# EAGLE design 001 Display (EAGLE 5.00)
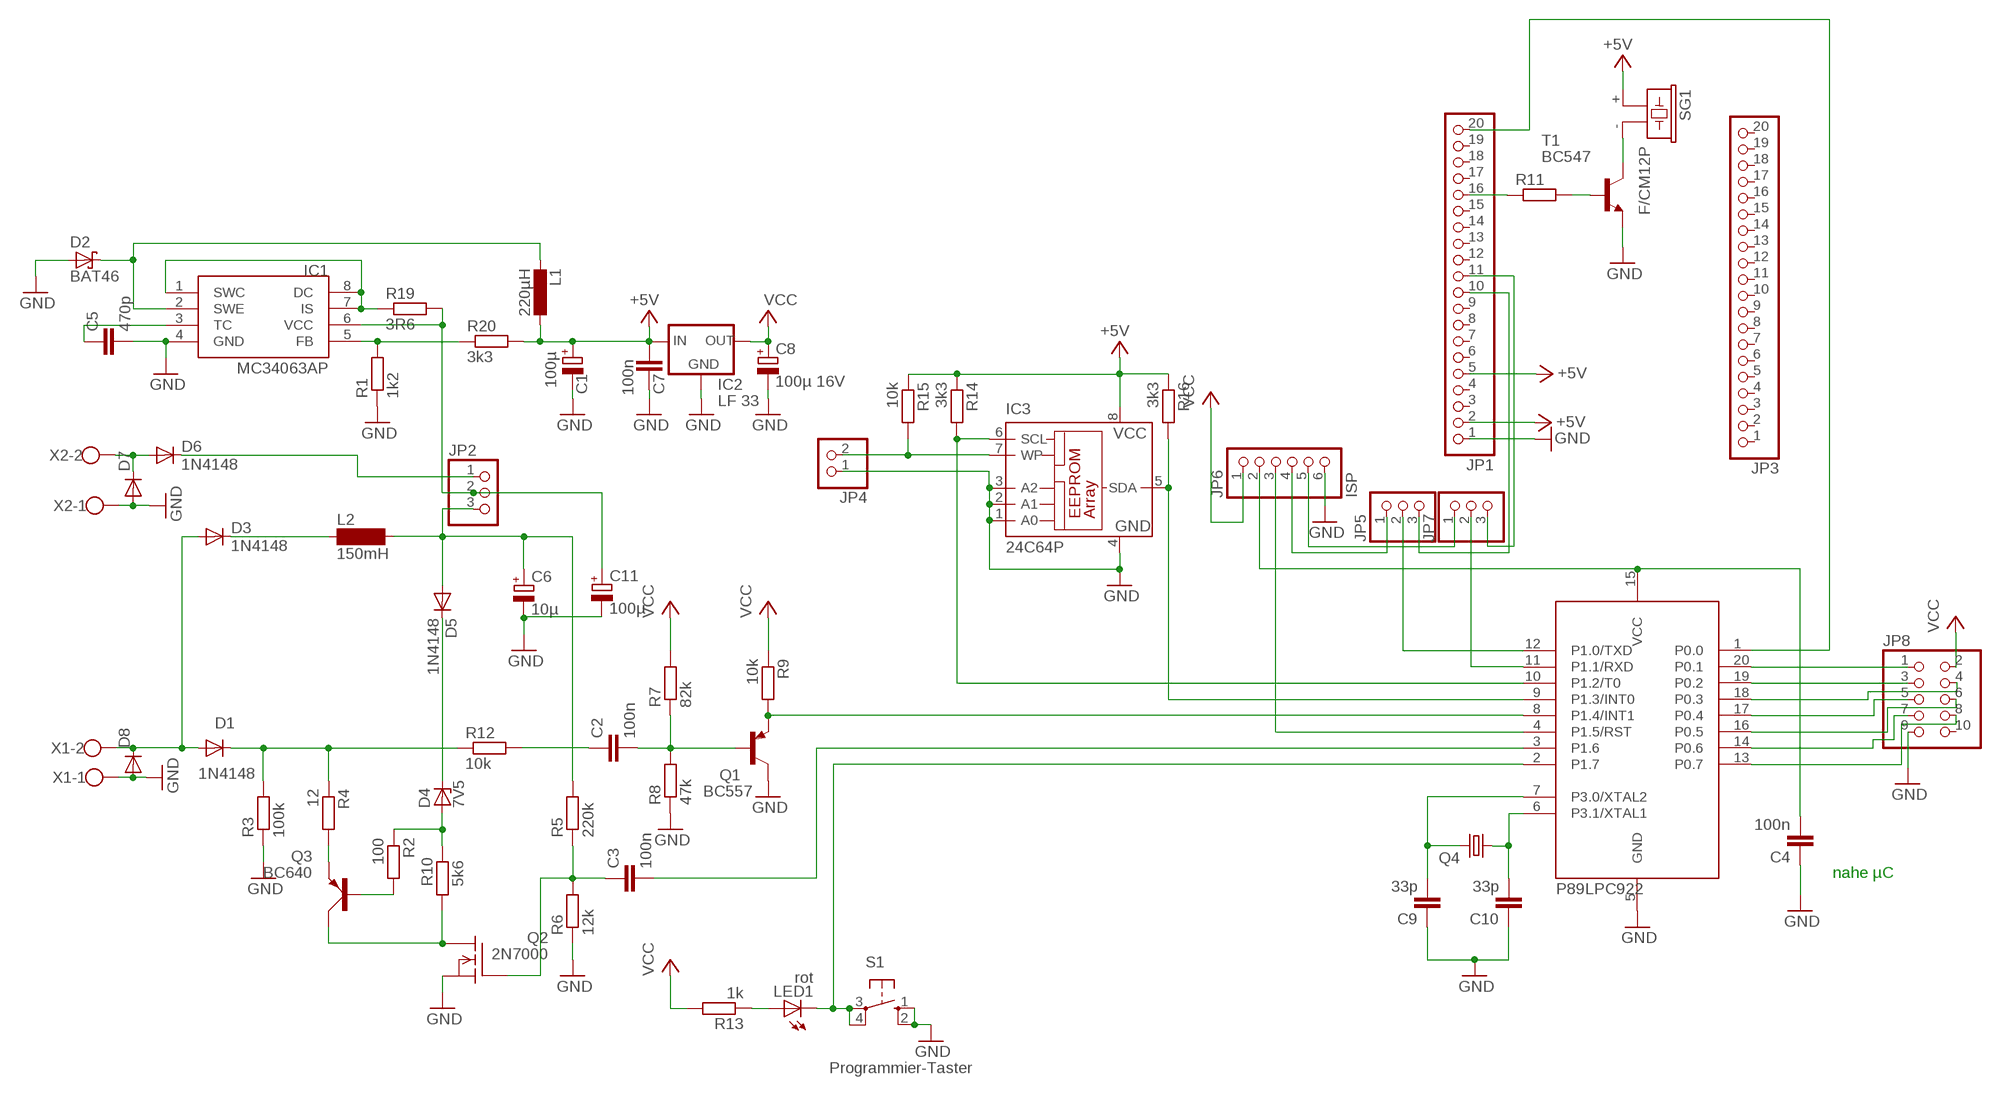
[diagram p0: schematic, sheet 1]

## Parts
C1  100µ  CPOL-EUE5-8.5  [E5-8,5]
C2  100n  C-EU050-024X044  [C050-024X044]
C3  100n  C-EU050-024X044  [C050-024X044]
C4  100n  C-EU050-024X044  [C050-024X044]
C5  470p  C-EU025-024X044  [C025-024X044]
C6  10µ  CPOL-EUE5-8.5  [E5-8,5]
C7  100n  C-EU050-024X044  [C050-024X044]
C8  100µ 16V  CPOL-EUE2-5  [E2-5]
C9  33p  C-EU050-024X044  [C050-024X044]
C10  33p  C-EU050-024X044  [C050-024X044]
C11  100µ  CPOL-EUE5-8.5  [E5-8,5]
D1  1N4148  [DO35-10]
D2  BAT46  BAT49  [DO41-10]
D3  1N4148  [DO35-10]
D4  7V5  ZPD  [DO35Z10]
D5  1N4148  [DO35-10]
D6  1N4148  [DO35-10]
D7  DIODE-SMB  [SMB]
D8  DIODE-SMB  [SMB]
IC1  MC34063AP  [DIL08]
IC2  LF 33  78XXL  [78XXL]
IC3  24C64P  [DIL8]
JP1  PINHD-1X20  [1X20]
JP2  PINHD-1X3  [1X03]
JP3  PINHD-1X20  [1X20]
JP4  PINHD-1X2  [1X02]
JP5  PINHD-1X3  [1X03]
JP6  ISP  PINHD-1X6  [1X06]
JP7  PINHD-1X3  [1X03]
JP8  PINHD-2X5  [2X05]
L1  220µH  L-EU2200-12.7  [2200-12.7]
L2  150mH  SD12-1000  [SD12_1000]
LED1  rot  LED3MM  [LED3MM]
Q1  BC557  [TO92]
Q2  2N7000  VN2222KM  [TO237]
Q3  BC640  [SOT54D]
Q4  CRYSTALHC49S  [HC49/S]
R1  1k2  R-EU_0207/10  [0207/10]
R2  100  R-EU_0207/10  [0207/10]
R3  100k  R-EU_0207/10  [0207/10]
R4  12  R-EU_0207/10  [0207/10]
R5  220k  R-EU_0207/10  [0207/10]
R6  12k  R-EU_0207/10  [0207/10]
R7  82k  R-EU_0207/10  [0207/10]
R8  47k  R-EU_0207/10  [0207/10]
R9  10k  R-EU_0207/10  [0207/10]
R10  5k6  R-EU_0207/10  [0207/10]
R11  R-EU_0204/7  [0204/7]
R12  10k  R-EU_0207/10  [0207/10]
R13  1k  R-EU_0207/10  [0207/10]
R14  3k3  R-EU_0207/10  [0207/10]
R15  10k  R-EU_0207/10  [0207/10]
R16  3k3  R-EU_0207/10  [0207/10]
R19  3R6  R-EU_0207/10  [0207/10]
R20  3k3  R-EU_0207/10  [0207/10]
S1  Programmier-Taster  10-XX  [B3F-10XX]
SG1  F/CM12P  [F/CM12P]
T1  BC547  [TO92]
U1  89LPC922  [DIL20]
X1  W237-102  [W237-102]
X2  W237-102  [W237-102]

## Nets
+5V: C1.+ C7.2 IC2.IN IC3.8(VCC) JP1.2 JP1.5 L1.1 R14.1 R15.1 R16.1 R20.2 SG1.+
GND: C1.- C4.1 C5.2 C6.- C7.1 C8.- C9.1 C10.1 C11.- D2.A D7.A D8.A IC1.4(GND) IC2.GND IC3.1(A0) IC3.2(A1) IC3.3(A2) IC3.4(GND) JP1.1 JP4.1 JP6.6 JP8.9 Q1.3(C) Q2.3(S) R1.1 R3.1 R6.1 R8.1 S1.1(S) S1.2(S1) T1.1(E) U1.5(GND) X1.1 X2.1
N$1: Q1.1(E) R9.2 U1.8(P1.4/INT1)
N$2: C2.2 Q1.2(B) R7.1 R8.2
N$3: C6.+ D5.A JP2.3 L2.2 R5.2
N$4: IC1.5(FB) R1.2 R20.1
N$5: C3.2 U1.3(P1.6)
N$6: Q2.1(D) Q3.C R10.1
N$7: IC1.1(SWC) IC1.7(IS) IC1.8(DC) R19.1
N$8: D3.C L2.1
N$9: D1.C R3.2 R4.1 R12.1
N$10: D2.C IC1.2(SWE) L1.2
N$11: D4.A R2.1 R10.2
N$12: Q3.E R4.2
N$13: C5.1 IC1.3(TC)
N$14: Q3.B R2.2
N$15: C11.+ IC1.6(VCC) JP2.2 R19.2
N$16: D1.A D3.A D8.C X1.2
N$17: D6.A D7.C X2.2
N$18: JP1.16 R11.1
N$19: R11.2 T1.2(B)
N$20: SG1.- T1.3(C)
N$21: JP6.5 JP7.1
N$22: C10.2 Q4.1 U1.6(P3.1/XTAL1)
N$23: C9.2 Q4.2 U1.7(P3.0/XTAL2)
N$24: LED1.K(C) S1.3(P) S1.4(P1) U1.2(P1.7)
N$25: IC3.5(SDA) R16.2 U1.9(P1.3/INT0)
N$26: JP6.3 U1.4(P1.5/RST)
N$27: JP5.1 JP6.4
N$28: IC3.6(SCL) R14.2 U1.10(P1.2/T0)
N$29: JP1.10 JP5.3
N$30: JP1.11 JP7.3
N$31: IC3.7(WP) JP4.2 R15.2
N$32: JP5.2 U1.12(P1.0/TXD)
N$33: JP7.2 U1.11(P1.1/RXD)
N$34: C3.1 Q2.2(G) R5.1 R6.2
N$35: D6.C JP2.1
N$36: C2.1 R12.2
N$37: C4.2 JP6.2 U1.15(VCC)
N$38: JP1.20 U1.1(P0.0)
N$40: D4.C D5.C
N$41: LED1.A R13.1
N$50: JP8.3 U1.19(P0.2)
N$51: JP8.4 U1.18(P0.3)
N$52: JP8.5 U1.17(P0.4)
N$53: JP8.1 U1.20(P0.1)
N$54: JP8.6 U1.16(P0.5)
N$55: JP8.7 U1.14(P0.6)
N$56: JP8.8 U1.13(P0.7)
VCC: C8.+ IC2.OUT JP6.1 JP8.2 R7.2 R9.1 R13.2
Unconnected: JP1.3 JP1.4 JP1.6 JP1.7 JP1.8 JP1.9 JP1.12 JP1.13 JP1.14 JP1.15 JP1.17 JP1.18 JP1.19 JP3.1 JP3.2 JP3.3 JP3.4 JP3.5 JP3.6 JP3.7 JP3.8 JP3.9 JP3.10 JP3.11 JP3.12 JP3.13 JP3.14 JP3.15 JP3.16 JP3.17 JP3.18 JP3.19 JP3.20 JP8.10

## Notes on the sheet
- nahe µC
- P89LPC922

## Library data of the parts
C1 C6 C8 C11 = rcl:CPOL-EU: POLARIZED CAPACITOR, European symbol
C2-C5 C7 C9 C10 = rcl:C-EU: CAPACITOR, European symbol
D1 D3 D5 D6 = diode:1N4148: DIODE high speed (Philips)
D2 = diode:BAT49: DIODE small signal diode
D4 = diode:ZPD: Z DIODE 500 mW
D7 D8 = diode:DIODE-: DIODE
IC1 = mc34063:MC34063
IC2 = v-reg:78XXL: VOLTAGE REGULATOR
IC3 = microchip:24*: Serial EEPROM I2C
JP1 JP3 = pinhead:PINHD-1X20: PIN HEADER
JP2 JP5 JP7 = pinhead:PINHD-1X3: PIN HEADER
JP4 = pinhead:PINHD-1X2: PIN HEADER
JP6 = pinhead:PINHD-1X6: PIN HEADER
JP8 = pinhead:PINHD-2X5: PIN HEADER
L1 = rcl:L-EU: INDUCTOR, European symbol
L2 = inductor-neosid:SD12: INDUCTOR nominal inductance
LED1 = led:LED: LED OSRAM: - CHIPLED LG R971, LG N971, LY N971, LG Q971, LY Q971, LO R971, LY R971 LH N974, LH R974 LS Q976, LO Q976, LY Q976 LO Q996 - Hyper CHIPLED LW Q18S LB Q993, LB Q99A, LB R99A - SideLED LS A670, LO A670, LY A670, LG A670, LP A670 LB A673, LV A673, LT A673, LW A673 LH A674 LY A675 LS A676, LA A676, LO A676, LY A676, LW A676 LS A679, LY A679, LG A679 - Hyper Micro SIDELED® LS Y876, LA Y876, LO Y876, LY Y876 LT Y87S - SmartLED LW L88C, LW L88S LB L89C, LB L89S, LG L890 LS L89K, LO L89K, LY L89K LS L896, LA L896, LO L896, LY L896 - TOPLED LS T670, LO T670, LY T670, LG T670, LP T670 LSG T670, LSP T670, LSY T670, LOP T670, LYG T670 LG T671, LOG T671, LSG T671 LB T673, LV T673, LT T673, LW T673 LH T674 LS T676, LA T676, LO T676, LY T676, LB T676, LH T676, LSB T676, LW T676 LB T67C, LV T67C, LT T67C, LS T67K, LO T67K, LY T67K, LW E67C LS E67B, LA E67B, LO E67B, LY E67B, LB E67C, LV E67C, LT E67C LW T67C LS T679, LY T679, LG T679 LS T770, LO T770, LY T770, LG T770, LP T770 LB T773, LV T773, LT T773, LW T773 LH T774 LS E675, LA E675, LY E675, LS T675 LS T776, LA T776, LO T776, LY T776, LB T776 LHGB T686 LT T68C, LB T68C - Hyper Mini TOPLED® LB M676 - Mini TOPLED Santana® LG M470 LS M47K, LO M47K, LY M47K Source: http://www.osram.convergy.de - LUMILED® LXK2-PW12-R00, LXK2-PW12-S00, LXK2-PW14-U00, LXK2-PW14-V00 LXK2-PM12-R00, LXK2-PM12-S00, LXK2-PM14-U00 LXK2-PE12-Q00, LXK2-PE12-R00, LXK2-PE12-S00, LXK2-PE14-T00, LXK2-PE14-U00 LXK2-PB12-K00, LXK2-PB12-L00, LXK2-PB12-M00, LXK2-PB14-N00, LXK2-PB14-P00, LXK2-PB14-Q00 LXK2-PR12-L00, LXK2-PR12-M00, LXK2-PR14-Q00, LXK2-PR14-R00 LXK2-PD12-Q00, LXK2-PD12-R00, LXK2-PD12-S00 LXK2-PH12-R00, LXK2-PH12-S00 LXK2-PL12-P00, LXK2-PL12-Q00, LXK2-PL12-R00 Source: www.luxeon.com
Q1 = transistor-pnp:BC557: PNP Transistor
Q2 = transistor-fet:VN2222KM: N-Channel Enhancement MOSFET (VMOS); 60V; 0,5A; 7,5Ohm
Q3 = transistor-small-signal:BC640: PNP TRANSISTOR
Q4 = crystal:CRYSTAL: CRYSTAL
R1-R16 R19 R20 = rcl:R-EU_: RESISTOR, European symbol
S1 = switch-omron:10-XX: OMRON SWITCH
SG1 = buzzer:F/CM12P: BUZZER Source: Buerklin
T1 = transistor:BC547: NPN TRANSISTOR
U1 = micro-philips:89LPC922
X1 X2 = con-wago-500:W237-102: WAGO SCREW CLAMP

## Board
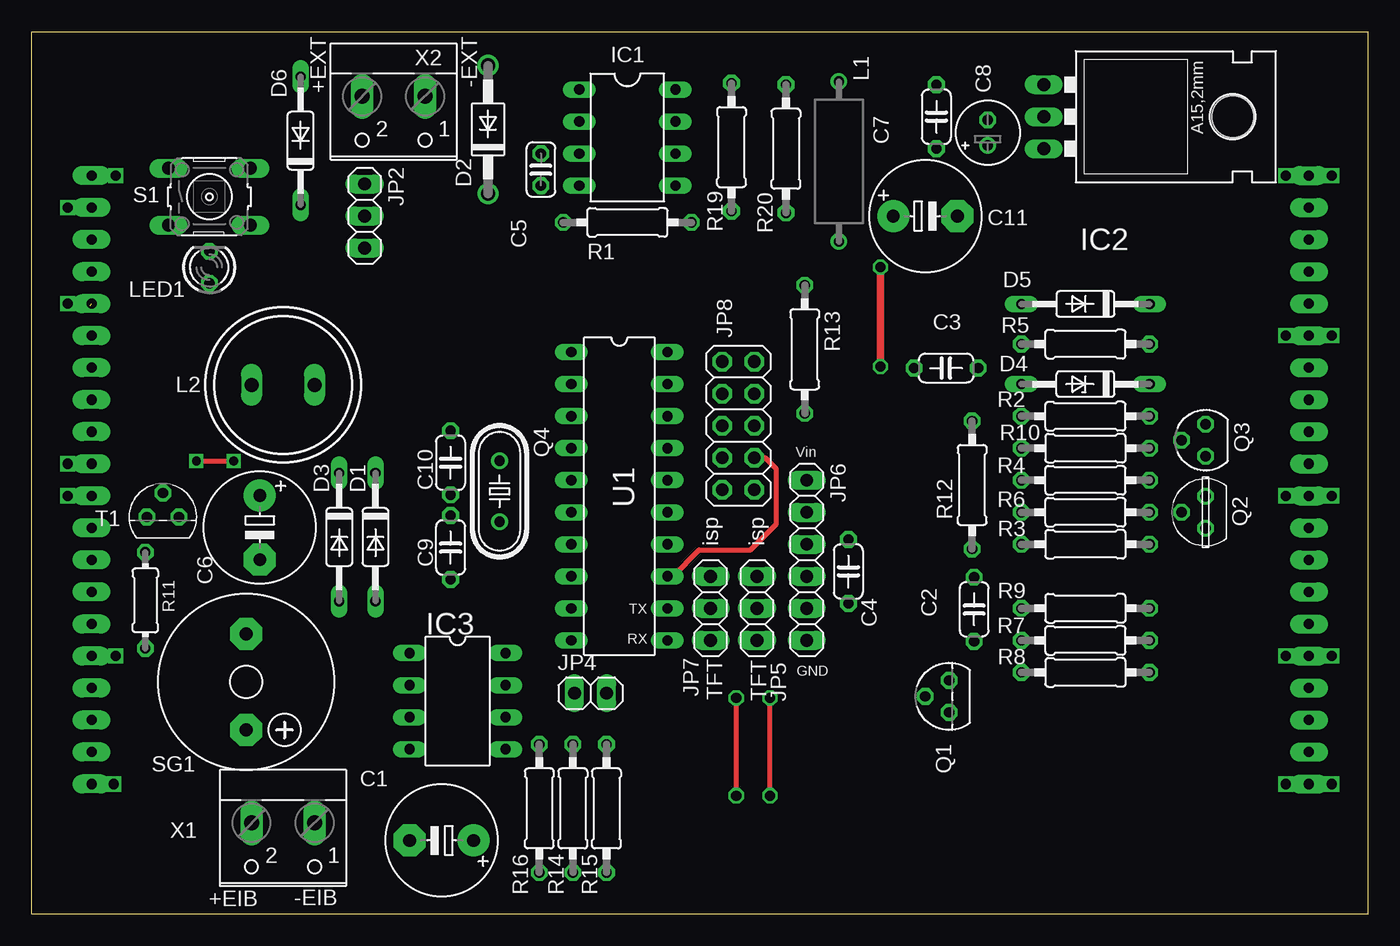
[diagram p1: board, top side]
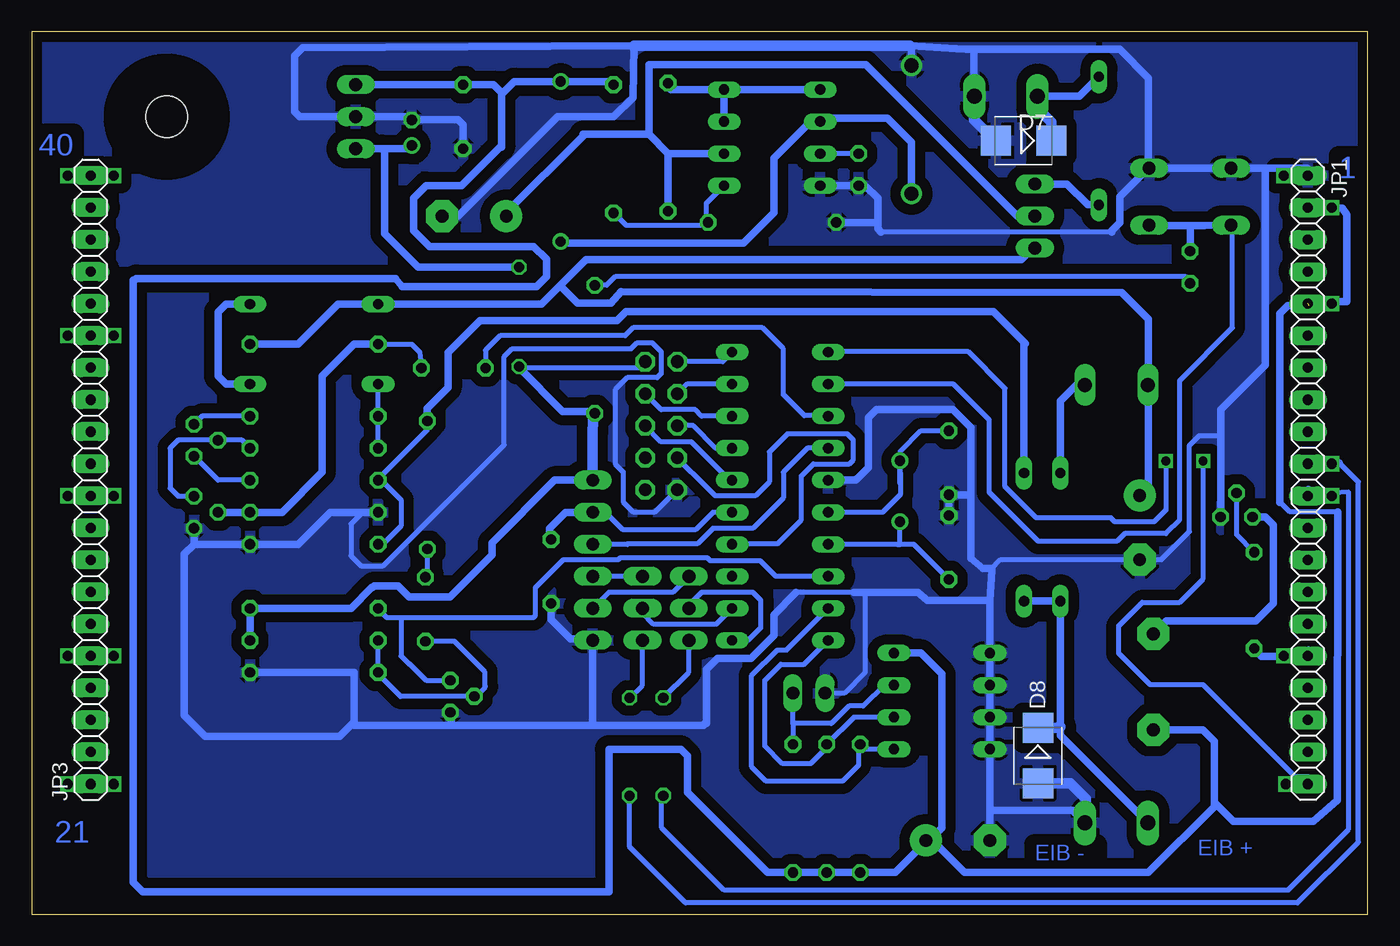
[diagram p2: board, bottom side, seen from below]

Size 105.98 x 70 mm. Coordinates in mm from the lower left corner, seen from the top.
Outline: 0,0 0,70 105.98,70 105.98,0 0,0
Copper layers (1*16): Top 0.035mm / dielectric 1.5mm / Bottom 0.035mm
Design rules "default *": minimum track width 10mil, minimum drill 24mil, track to track 12mil, track to pad 12mil, pad to pad 12mil, via to via 12mil, smd to smd 8mil, copper to edge 20mil, drill to drill 8mil, minimum pad ring 10mil, minimum via ring 8mil, stop-mask expansion 4mil, vias tented up to drill 0mil, thermal gap 10mil

### Footprints (pad centres in the part's own frame; a part is rotated, then mirrored left to right if it is on the bottom)
E5-8,5 = drill 1.016 pad 2.54 round: + -2.54,0 | drill 1.016 pad 2.54 octagon: - 2.54,0
C050-024X044 = drill 0.813 octagon: 1 -2.54,0; 2 2.54,0
C025-024X044 = drill 0.813 octagon: 1 -1.27,0; 2 1.27,0
E2-5 = drill 0.813 pad 1.27 round: + -1.016,0 | drill 0.813 pad 1.27 octagon: - 1.016,0
DO35-10 = drill 0.813 long: A 5.08,0; C -5.08,0
DO41-10 = drill 1.118 round: A 5.08,0; C -5.08,0
DO35Z10 = drill 0.813 long: A 5.08,0; C -5.08,0
SMB = smd 2.4 x 2.4: A 2.2,0; C -2.2,0
DIL08 = drill 0.813 long: 1 -3.81,-3.81; 2 -1.27,-3.81; 3 1.27,-3.81; 4 3.81,-3.81; 5 3.81,3.81; 6 1.27,3.81; 7 -1.27,3.81; 8 -3.81,3.81
78XXL = drill 1.016 long: GND 0,-3.81; IN -2.54,-3.81; OUT 2.54,-3.81 | hole 3.302: 0,11.176
DIL8 = drill 0.813 long: 1 -3.81,-3.81; 2 -1.27,-3.81; 3 1.27,-3.81; 4 3.81,-3.81; 5 3.81,3.81; 6 1.27,3.81; 7 -1.27,3.81; 8 -3.81,3.81
1X20 = drill 0.8 pad 1.5 long: 1 -24.13,0; 2 -21.59,0; 3 -19.05,0; 4 -16.51,0; 5 -13.97,0; 6 -11.43,0; 7 -8.89,0; 8 -6.35,0; 9 -3.81,0; 10 -1.27,0; 11 1.27,0; 12 3.81,0; 13 6.35,0; 14 8.89,0; 15 11.43,0; 16 13.97,0; 17 16.51,0; 18 19.05,0; 19 21.59,0; 20 24.13,0
1X03 = drill 1.016 long: 1 -2.54,0; 2 0,0; 3 2.54,0
1X02 = drill 1.016 long: 1 -1.27,0; 2 1.27,0
1X06 = drill 1.016 long: 1 -6.35,0; 2 -3.81,0; 3 -1.27,0; 4 1.27,0; 5 3.81,0; 6 6.35,0
2X05 = drill 1.016 octagon: 1 -5.08,-1.27; 2 -5.08,1.27; 3 -2.54,-1.27; 4 -2.54,1.27; 5 0,-1.27; 6 0,1.27; 7 2.54,-1.27; 8 2.54,1.27; 9 5.08,-1.27; 10 5.08,1.27
2200-12.7 = drill 0.8 pad 1.27 round: 1 -6.35,0; 2 6.35,0
SD12_1000 = drill 1.1 long: 1 -2.5,0; 2 2.5,0
LED3MM = drill 0.813 octagon: A -1.27,0; K 1.27,0
TO92 = drill 0.813 octagon: 1 1.27,0; 2 0,1.905; 3 -1.27,0
TO237 = drill 0.813 octagon: 1 1.27,0; 2 0,1.905; 3 -1.27,0
SOT54D = drill 0.813 octagon: B 1.27,0; C 0,1.905; E -1.27,0
HC49/S = drill 0.813 round: 1 -2.413,0; 2 2.413,0
0207/10 = drill 0.813 octagon: 1 -5.08,0; 2 5.08,0
0204/7 = drill 0.813 octagon: 1 -3.81,0; 2 3.81,0
B3F-10XX = drill 1.016 long: 1 -3.251,2.261; 2 3.251,2.261; 3 -3.251,-2.261; 4 3.251,-2.261
F/CM12P = drill 1.016 pad 2.54 octagon: + 3.81,0; - -3.81,0
DIL20 = drill 0.813 long: 1 -11.43,-3.81; 2 -8.89,-3.81; 3 -6.35,-3.81; 4 -3.81,-3.81; 5 -1.27,-3.81; 6 1.27,-3.81; 7 3.81,-3.81; 8 6.35,-3.81; 9 8.89,-3.81; 10 11.43,-3.81; 11 11.43,3.81; 12 8.89,3.81; 13 6.35,3.81; 14 3.81,3.81; 15 1.27,3.81; 16 -1.27,3.81; 17 -3.81,3.81; 18 -6.35,3.81; 19 -8.89,3.81; 20 -11.43,3.81
W237-102 = drill 1.194 long: 1 -2.5,-1.27; 2 2.5,-1.27

### Placement (x,y rotation side)
C1  32.52,5.83 180 top
C2  74.74,24.17 270 top
C3  72.52,43.3 180 top
C4  64.77,27.17 90 top
C5  40.39,59.05 270 top
C6  18.1,30.65 270 top
C7  71.76,63.24 90 top
C8  75.82,61.97 90 top
C9  33.23,29.07 270 top
C10  33.23,35.79 90 top
C11  70.87,55.36 0 top
D1  27.27,29.9 270 top
D2  36.2,62.22 90 top
D3  24.39,29.9 270 top
D4  83.57,42.03 180 top
D5  83.57,48.38 180 top
D6  21.34,61.33 90 top
D7  27.31,61.33 180 bottom
D8  26.17,12.57 270 bottom
IC1  47.25,61.59 270 top
IC2  84.08,63.24 270 top
IC3  33.79,16.88 270 top
JP1  4.77,34.44 270 bottom
JP2  26.42,55.36 270 top
JP3  101.29,34.44 90 bottom
JP4  44.33,17.52 0 top
JP5  57.53,24.25 270 top
JP6  61.47,28.06 270 top
JP7  53.85,24.25 270 top
JP8  56.04,38.73 270 top
L1  64.01,59.68 270 top
L2  19.95,41.97 180 top
LED1  14.1,51.3 90 top
Q1  72.78,17.26 90 top
Q2  93.09,31.87 90 top
Q3  93.09,37.58 90 top
Q4  37.11,33.53 270 top
R1  47.25,54.86 0 top
R2  83.57,39.49 0 top
R3  83.57,29.33 180 top
R4  83.57,34.41 0 top
R5  83.57,45.2 0 top
R6  83.57,31.87 0 top
R7  83.57,21.71 0 top
R8  83.57,19.17 180 top
R9  83.57,24.25 180 top
R10  83.57,36.95 180 top
R11  9.02,24.88 90 top
R12  74.58,34.03 270 top
R13  61.31,44.79 270 top
R14  42.93,8.37 90 top
R15  45.6,8.37 90 top
R16  40.26,8.37 90 top
R19  55.5,60.82 270 top
R20  59.82,60.7 90 top
S1  14.1,56.89 0 top
SG1  17.02,18.41 270 top
T1  10.42,31.49 0 top
U1  46.61,33.14 270 top
X1  19.94,5.96 180 top
X2  28.71,63.58 180 top

### Tracks (layer width: path | path; a pad name or v marks a point on that pad's centre or on a via)
+5V  (1 unrouted)
  Bottom 0.406: 2.38,31.9 6.19,31.9 6.99,32.7
  Bottom 0.61: 4.69,56 JP1.2 4.63,55.95 4.83,55.83 4.5,56 2.05,56 1.7,55.49 1.7,48.57 4.78,48.57 | 12.2,8.76 12.2,8.5 17.4,3.29 32.01,3.29 34.55,5.83 C1.+ | 12.2,8.76 12.2,13.71 13.08,14.6 SG1.+ | IC2.IN C7.2 69.35,65.78 68.71,65.14 68.71,65.02 | 68.71,65.02 67.7,66.03 L1.1 59.69,66.03 R20.2 | 4.67,48.25 6.35,48.25 6.99,47.62 6.99,32.7 6.99,32.63 | 2.38,31.9 2.42,9.01 4.32,7.36 10.67,7.36 12.07,8.76 12.2,8.76 | IC3.8 35.44,20.69 33.79,19.04 33.79,6.85 34.93,5.71 C1.+ | C1.+ 34.93,5.83 37.47,3.29 R16.1 R14.1 R15.1 47.63,3.29 53.98,9.64 53.98,12.57 54.49,13.07 60.2,13.07 60.2,1.77 97.16,1.77 97.92,2.53 97.92,50.28 97.79,50.28 97.67,50.41 77.09,50.41 76.59,49.78 65.92,49.78 65.16,50.54 65.16,51.93 66.17,52.95 74.43,52.95 75.7,54.22 75.7,56.76 74.68,57.78 71.89,57.78 68.71,60.95 | 68.71,60.95 68.71,65.02 | 68.71,60.95 68.71,60.82 | 4.78,48.57 4.74,48.61 JP1.5 | 4.78,48.57 4.83,48.84
GND
  Bottom 0.406: 20.32,54.09 38.61,54.09 | 45.41,25.46 45.47,25.52 40.77,25.52 | 39.88,25.52 39.88,19.17 41.53,17.52 JP4.1 | 11.69,38.11 11.67,38.11 11.83,37.95 13.38,37.95 14.16,37.17 14.16,30.33 16.38,28.11 C6.- 29.14,28.11 29.87,27.37 29.82,27.32 29.82,27.27 | JP8.9 54.93,33.65 | 76.36,29.36 68.58,37.14 | 76.36,29.36 | 76.36,29.36 78.11,27.61 79.86,27.61 80.65,28.41 80.65,30.95 79.86,31.74 79.86,31.87 | JP8.9 | JP8.9 56.52,31.9 58.27,31.9 59.06,32.7 59.06,35.08 59.69,35.71 59.69,41.59 58.74,42.54 56.36,42.54 56.04,42.85 56.04,44.6 56.76,45.31 57.95,45.31 58.42,44.84 67.87,44.84 68.51,44.2 68.51,37.22 68.58,37.14 | 68.58,37.14
  Bottom 0.61: 80.4,17.16 80.4,15.99 | 80.4,17.16 80.4,19.17 R8.1 | R6.1 79.86,31.87 82.3,31.87 84.84,29.33 88.52,29.33 88.65,29.46 R3.1 93.09,29.33 | 93.09,29.33 Q2.3 | 80.4,15.61 80.4,14.98 72.65,14.98 | 80.4,15.61 80.4,17.16 | U1.5 40.61,34.41 39.6,35.42 39.6,39.36 38.96,40 32.9,40 31.5,38.6 31.5,33.39 | IC3.2 29.98,18.28 | IC3.2 IC3.3 IC3.4 29.98,8.37 | IC3.1 29.98,20.82 | IC3.2 IC3.1 | 31.5,33.27 31.5,33.25 | 31.5,33.39 31.5,33.65 | 29.98,8.37 29.98,8.25 23.46,8.25 X1.1 | JP1.1 4.8,59.17 8.19,59.17 8.25,59.11 8.25,59.17 | 8.25,59.17 8.13,59.17 8.13,43.55 11.69,40 11.69,38.11 T1.1 | 8.25,59.17 12.98,59.17 S1.1 13.03,59.17 15.68,59.17 S1.2 | 31.12,68.57 31.25,68.57 31.25,64.89 X2.1 | 93.09,29.33 93.86,28.57 93.86,15.74 92.21,14.09 81.54,14.09 80.4,15.23 80.4,15.61 | 43.31,57.65 IC1.4 C5.2 39.88,57.78 38.87,56.76 38.87,54.86 | 31.12,68.57 31.88,68.57 32.64,68.62 36.33,68.86 36.33,68.65 36.2,68.52 D2.A | 58.22,68.86 84.46,68.7 85.09,68.06 85.09,63.62 84.71,63.24 IC2.GND | IC2.GND 79.89,63.24 | C7.1 71.76,62.6 72.14,62.98 C8.- | 38.61,54.09 38.87,54.35 38.87,54.86 | 38.87,54.86 R1.1 | C8.- 75.95,62.98 | C8.- 76.08,63.24 IC2.GND | 31.5,33.27 31.5,28.22 30.55,27.43 29.98,27.43 arc91 29.82,27.27 29.98,24.88 | 31.5,33.27 31.5,33.39 | 45.34,25.52 45.41,25.46 47.12,23.74 47.12,22.09 48.93,20.28 51.57,20.28 52.45,19.39 52.45,16.38 | 61.47,14.98 JP6.6 61.47,21.84 63.25,21.84 64.77,23.36 C4.1 | 61.47,14.98 72.65,14.98 | 72.65,14.98 Q1.3 | 52.45,16.38 52.45,16.25 | IC3.1 29.98,24.88 | 33.16,33.25 33.15,33.27 | 33.16,33.25 C10.1 31.51,33.25 31.5,33.27 | C9.1 33.23,33.19 33.16,33.25 | 31.12,68.57 19.69,68.57 17.4,66.29 17.4,59.3 17.28,59.17 17.3,59.15 S1.2
  Bottom 0.61: 20.32,54.09 20.32,54.22 19.69,54.86 19.69,56.89 17.43,59.15 S1.2 | 29.98,8.37 C1.- | 52.45,16.38 52.45,15.11 52.58,15.11 52.71,14.98 61.47,14.98 | C11.- 72.14,55.36 64.27,63.24 59.82,63.24 58.3,64.76 58.22,68.86 | 58.22,68.86 58.3,68.67 | 29.98,24.88 34.93,24.88 35.69,25.52 39.88,25.52 40.77,25.52
  Bottom 0.813: 36.33,68.86 58.22,68.86 | D8.A 23.59,10.37 22.36,9.14 22.36,7.49 22.44,7.4 X1.1 | D7.A 29.6,61.33 31.25,62.98 31.25,64.89 X2.1
  pour Bottom (isolate 0.813): -0.89,70.6 106.81,70.6 107.45,69.97 107.45,-0.26 106.94,-0.77 -1.27,-0.77 -1.27,69.33
N$1
  Bottom 0.406: Q1.1 74.68,18.53 75.95,19.8 76.01,19.8 76.68,20.47 76.68,23.49 | R9.2 78.49,24.19 77.79,23.49 76.68,23.49 | 76.68,23.49 66.2,23.49 66.04,23.65 66.04,25.87 63.82,28.09 59.46,28.09 59.3,28.25 52.39,28.25 52.15,28.01 48.18,28.01 46.96,26.79 U1.8
N$2
  Bottom 0.406: R7.1 R8.2 78.49,19.04 76.71,17.26 Q1.2 70.87,17.14 69.98,18.03 69.98,18.06 70.01,18.09 70.01,19.2 72.44,21.63 C2.2
N$3
  Bottom 0.61: R5.2 84.84,45.2 81.67,48.38 D5.A 65.52,48.38 64.06,49.84 | 17.41,41.97 L2.2 | 17.41,41.97 17.41,47.21 18.64,48.43 | 18.64,48.43 18.68,48.48 | 26.29,52.95 JP2.3 26.48,52.82 26.52,52.86 27.47,51.9 62,51.9 64.06,49.84 | C6.+ 18.05,33.13 17.41,33.77 17.41,41.97 | 64.06,49.84 | 64.06,49.84 62.7,48.48 60.03,48.48 59.22,49.36 19.53,49.28 18.66,48.41 18.64,48.43
N$4
  Bottom 0.406: IC1.5 52.45,56.38 52.45,54.86 R1.2 52.58,54.6 58.8,54.6 R20.1 59.69,55.62
N$5
  Bottom 0.406: C3.2 69.98,44.71 68.82,45.87 58.9,45.87 58.27,46.51 48.03,46.51 46.36,44.84 46.36,41.19 44.69,39.52 42.95,39.52 42.91,39.49 U1.3
N$6
  Bottom 0.406: R10.1 89.29,37.58 Q3.C 94.37,37.58 95,36.95 95,33.77 94.37,33.14 Q2.1
N$7
  Bottom 0.61: IC1.1 IC1.8 | IC1.8 IC1.7 | IC1.8 55.25,65.4 55.5,65.65 R19.1
N$8
  Bottom 0.61: D3.C 24.39,40.7 23.12,41.97 L2.1
N$9
  Bottom 0.406: 78.4,29.33 R3.2 78.4,29.33 | 74.62,39.2 74.59,39.17 R12.1 74.59,38.44 78.59,34.44 78.55,34.41 R4.1 78.24,34.41 76.68,32.85 76.68,30.79 78.27,29.2 78.4,29.33
  Bottom 0.61: D1.C 27.27,45.24 | 27.27,45.24 27.27,45.3 | 74.62,39.2 74.62,40.08 72.95,41.74 72.95,44.52 70.41,47.06 59.53,47.06 58.82,47.78 29.69,47.78 27.15,45.24 27.27,45.24
N$10
  Bottom 0.61: D2.C 36.2,61.21 38.1,63.11 43.44,63.11 IC1.2 44.2,62.86 47.12,59.94 47.12,55.62 49.53,53.2 63.63,53.2 L1.2
N$11
  Bottom 0.406: D4.A R2.1 R10.2
N$12
  Bottom 0.406: R4.2 91.19,34.41 Q3.E
N$13
  Bottom 0.406: C5.1 IC1.3
N$14
  Bottom 0.406: Q3.B 92.46,39.49 R2.2
N$15
  Bottom 0.61: JP2.2 27.82,55.36 39.82,67.37 57.03,67.37 57.03,61.84 | 57.03,61.84 55.5,60.32 | 50.93,60.32 IC1.6 55.5,60.32 | 55.5,60.32 R19.2 | 57.03,61.84 62.23,61.84 62.23,61.71 68.33,55.62 C11.+
N$16
  Bottom 0.61: D1.A D3.A | D3.A 24.39,24.88 | X1.2 24.39,14.18 24.39,14.85 D3.A
  Bottom 0.813: 24.39,14.85 24.52,14.85 24.6,14.77 D8.C
N$17
  Bottom 0.61: X2.2 22.9,64.85 D6.A
  Bottom 0.813: D7.C 25.11,62.82 26.29,64 26.29,64.64 26.17,64.76 26.21,64.81 X2.2
N$18
  Bottom 0.406: 4.23,20.44 4.7,21.06 JP1.16
  Bottom 0.61: 9.02,21 9.03,21 | 9.02,21 R11.1 | 4.23,20.44 8.47,20.44 9.02,21
N$19
  Bottom 0.406: R11.2 10.42,30.09 T1.2
N$20
  Bottom 0.61: SG1.- 16.01,23.23 8.89,23.23 7.5,24.63 7.5,30.85 8.13,31.49 T1.3
N$21
  Bottom 0.406: JP7.1 55.12,25.52 60.2,25.52 JP6.5 61.6,24.25
N$22
  Bottom 0.406: U1.6 38.48,31.87 37.09,33.27 37.09,34.14 Q4.1 37.1,34.15 37.09,34.15 37.09,36.7 35.44,38.35 33.24,38.35 C10.2
N$23
  Bottom 0.406: 37.1,29.33 37.09,29.33 | 37.1,29.33 Q4.2 37.12,29.33 37.34,29.33 | 37.34,29.33 37.1,29.33 | 37.34,29.33 U1.7 | C9.2 36.02,29.33 37.34,29.33
N$24
  Bottom 0.406: U1.2 32.86,42.03 30.03,39.2 30.03,33.44 26.14,29.55 19.92,29.55 19.29,30.18 16.02,30.18 14.94,31.26 14.94,42.31 10.74,46.51 10.74,54.29 10.89,54.44 10.85,54.49 S1.3
  Bottom 0.61: 12.98,54.6 12.96,54.6 | S1.4 17.2,54.6 14.1,54.6 | 12.98,54.6 14.1,54.6 | S1.3 12.98,54.6 | 14.1,54.6 LED1.K
N$25
  Bottom 0.406: U1.9 46.1,20.95 46.84,20.95 48.87,18.91 48.87,11.68 47.73,10.53 41.66,10.53 40.39,11.8 40.39,13.45 R16.2 39.88,13.07 IC3.5
N$26
  Bottom 0.406: U1.4 44.45,36.95 46.36,35.04 46.36,33.01 48.77,30.6 51.95,30.6 53.18,29.36 58.74,29.36 58.74,29.33 | 58.74,29.33 58.68,29.33 | 58.74,29.33 JP6.3
N$27
  Bottom 0.406: 61.6,26.79 JP6.4 JP5.1
N$28
  Bottom 0.406: IC3.6 40.77,15.61 R14.2 42.93,13.2 44.2,11.93 46.43,11.93 47.83,13.33 47.83,18.53 46.56,19.8 44.71,19.8 U1.10
N$29  (via drill 0.8)
  Top 0.406: 58.55,9.26 v58.55,9.39 v58.55,17.14
  Bottom 0.406: JP5.3 57.53,18.15 v58.55,17.14 | 2.27,35.78 0.77,34.28 0.77,5.71 5.59,0.88 54.11,0.88 58.55,5.33 v58.55,9.39 58.55,9.64
  Bottom 0.61: JP1.10 4.43,35.84 4.67,35.77 4.02,35.78 2.27,35.78
N$30  (via drill 0.8)
  Top 0.406: v55.88,9.39 v55.88,17.14
  Bottom 0.406: JP7.3 53.85,19.17 v55.88,17.14 | 2.74,33.4 1.53,33.46 1.53,6.72 6.35,1.9 51.06,1.9 56.01,6.85 56.01,9.14 55.88,9.26 v55.88,9.39
  Bottom 0.61: JP1.11 4.74,33.67 4.67,33.6 4.55,33.4 2.74,33.4
N$31
  Bottom 0.406: IC3.7 38.36,18.15 40.01,16.5 41.15,16.5 42.55,15.11 45.6,15.11 | 45.34,13.2 45.47,13.2 R15.2 45.6,15.11 | 45.6,15.11 JP4.2
N$32
  Bottom 0.406: U1.12 51.69,22.98 56.65,22.98 57.53,23.87 JP5.2
N$33
  Bottom 0.406: U1.11 49.15,21.71 48.14,22.73 48.14,24.88 48.77,25.52 52.84,25.52 53.85,24.5 JP7.2
N$34
  Bottom 0.406: C3.1 75.19,44.57 75.82,45.2 R5.1
  Bottom 0.61: R5.1 80.4,45.2 82.94,42.66 82.94,35.04 86.11,31.87 R6.2 Q2.2
N$35
  Bottom 0.61: D6.C 22.23,56.25 23.88,57.9 26.29,57.9 26.42,58.03 JP2.1
N$36
  Bottom 0.406: 74.74,26.54 74.78,26.5 | C2.1 74.74,26.54 | R12.2 74.59,26.69 74.74,26.54
N$37
  Bottom 0.406: U1.15 51.95,31.87 53.34,30.47 59.06,30.47 60.49,31.9 61.44,31.9 JP6.2 | JP6.2
  Bottom 0.61: JP6.2 63.63,31.87 64.9,30.6 64.9,29.71 C4.2
N$38  (via drill 0.7)
  Top 0.406: v13.07,35.93 v16.03,35.93
  Bottom 0.406: v16.03,35.93 16.03,32.04 16.96,31.11 20.07,31.11 20.38,31.42 26.3,31.42 28.79,33.91 28.79,41.69 31.7,44.6 42.77,44.6 U1.1 | v13.07,35.93 13.07,26.6 14.94,24.73 17.89,24.73 19.76,22.86 19.76,20.68 17.27,18.19 13.07,18.19 5.76,10.88 4.67,10.88 4.69,10.86 JP1.20
N$39  (via drill 0.8)
  other vias: 2.86,35.71
N$40
  Bottom 0.61: D4.C 90.56,42.03 91.19,42.66 91.19,47.74 90.56,48.38 D5.C
N$41
  Bottom 0.406: R13.1 60.38,49.87 59.69,50.55 14.45,50.55 14.1,50.2 LED1.A
N$42  (via drill 0.8)
  other vias: 2.86,33.17
N$44  (via drill 0.8)
  other vias: 6.67,20.47
N$45  (via drill 0.8)
  other vias: 6.51,10.31
N$46  (via drill 0.8)
  other vias: 2.86,48.41
N$47  (via drill 0.8)
  other vias: 2.86,56.03
N$48  (via drill 0.8)
  other vias: 6.67,58.57
N$49  (via drill 0.7)
  other vias: 95.25,63.25
N$50
  Bottom 0.406: JP8.3 | U1.19 54.01,42.03 JP8.3
N$51
  Bottom 0.406: U1.18 52.84,39.49 53.34,40 56.04,40 JP8.4 | JP8.4
N$52
  Bottom 0.406: U1.17 51.72,36.95 53.5,38.73 JP8.5 | JP8.5
N$53
  Bottom 0.406: JP8.1 | U1.20 51.18,43.81 JP8.1
N$54
  Bottom 0.406: U1.16 50.61,34.41 53.66,37.46 56.04,37.46 JP8.6 | JP8.6
N$55
  Bottom 0.406: 50.42,29.27 50.49,29.2 | 50.42,29.27 U1.14 | 50.42,29.27 50.33,29.36 46.84,29.36 44.93,31.27 44.93,34.76 43.98,35.71 41.12,35.71 40.8,36.03 40.8,37.62 41.28,38.09 46.04,38.09 47.47,36.66 47.47,34.28 48.58,33.17 51.76,33.17 52.39,33.81 JP8.7 | JP8.7
N$56
  Top 0.406: U1.13 50.85,26.79 52.95,28.88 56.99,28.88 59.06,30.95 59.06,35.31 58.19,36.19 57.39,36.19 57.31,36.27 JP8.8
N$57  (via drill 0.8)
  other vias: 99.46,10.31
N$59  (via drill 0.8)
  other vias: 103.11,10.31
N$60  (via drill 0.8)
  other vias: 99.46,45.87
N$61  (via drill 0.8)
  other vias: 103.11,45.87
N$62  (via drill 0.8)
  other vias: 99.46,58.57
N$63  (via drill 0.8)
  other vias: 103.11,58.57
N$64  (via drill 0.8)
  other vias: 99.46,33.17
N$65  (via drill 0.8)
  other vias: 103.11,33.17
N$66  (via drill 0.8)
  other vias: 99.46,20.47
N$67  (via drill 0.8)
  other vias: 103.11,20.47
VCC  (via drill 0.8)
  Top 0.61: v67.31,43.43 v67.31,51.3
  Bottom 0.406: C8.+ 75.82,60.82 | 78.9,25.87 78.93,25.9 79,25.9 | JP8.2 57.79,43.33 67.16,43.33 67.31,43.49 | JP6.1 61.73,34.41 61.76,34.44
  Bottom 0.61: R7.2 R9.1 80.65,24.25 79,25.9 | 80.27,60.82 81.16,60.82 | C8.+ 76.08,60.7 77.98,60.7 | 77.98,60.7 IC2.OUT | v67.31,51.3 75.32,51.3 77.98,53.97 77.98,60.7 | 67.31,43.49 v67.31,43.43 67.31,43.33 63.85,39.87 61.41,39.87 | 61.73,34.41 64.49,34.41 69.46,29.44 69.46,28.49 72.79,25.15 76.05,25.15 76.92,26.03 78.82,26.03 78.93,25.92 78.93,25.9
  Bottom 0.813: IC2.OUT 80.27,60.82 | JP6.1 61.47,38.22 61.41,39.87 R13.2

### Text on the board
Bottom: 40 | 1 | 21 | EIB + | EIB -
tPlace: +EXT | -EXT | Vin | isp | isp | TX | RX | TFT | TFT | GND | +EIB | -EIB